# Altium project Mic_Amplifier.PrjPcb
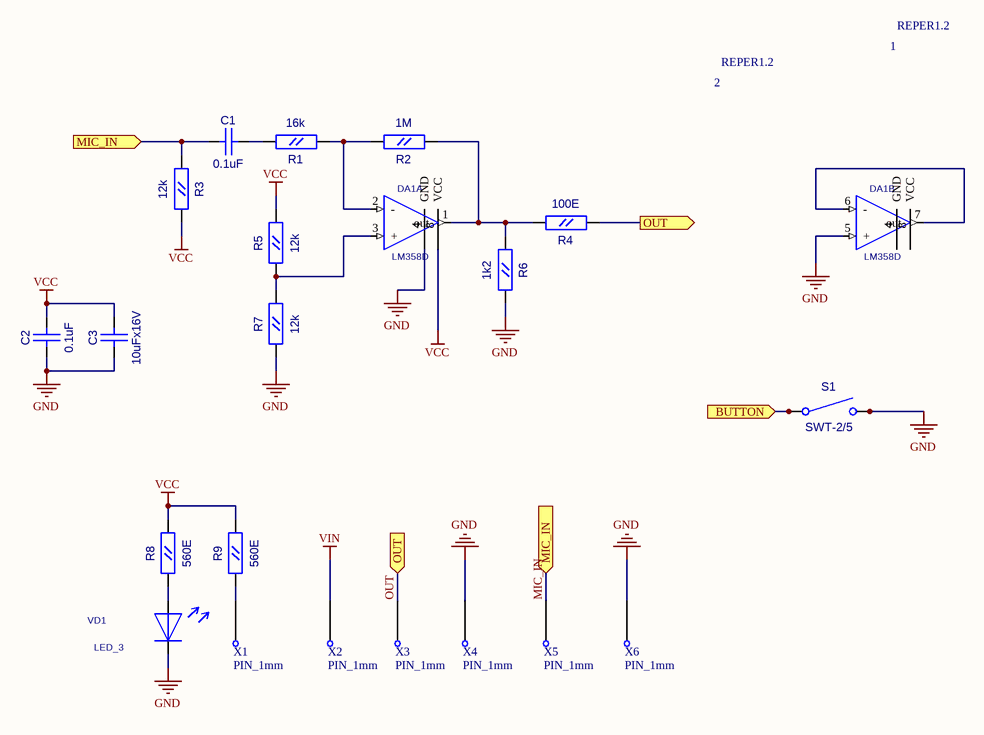
[diagram p0: Main.SchDoc]
2 sheets, 43 parts. Net scope: flat (ports and power ports of the same name join across sheets).
Board file: Mic_Amplifier.PcbDoc
Sheets:
  Main.SchDoc
  ON_OFF.SchDoc

## Sheet Main.SchDoc
size A4

### Parts
1  REPER1.2  [REPER1.2]
2  REPER1.2  [REPER1.2]
C1  0.1uF  [CC0805]
C2  0.1uF  [CC0805]
C3  10uFx16V  [CC0805]
DA1  LM358D  [SO-8]  (parts A,B of 2)
R1  16k  [RC0805]
R2  1M  [RC0805]
R3  12k  [RC0805]
R4  100E  [RC0805]
R5  12k  [RC0805]
R6  1k2  [RC0805]
R7  12k  [RC0805]
R8  560E  [RC0805]
R9  560E  [RC0805]
S1  SWT-2/5  [7906H-1]
VD1  LED_3  [LED3]
X1  PIN_1mm  [PIN_1mm]
X2  PIN_1mm  [PIN_1mm]
X3  PIN_1mm  [PIN_1mm]
X4  PIN_1mm  [PIN_1mm]
X5  PIN_1mm  [PIN_1mm]
X6  PIN_1mm  [PIN_1mm]

### Ports
BUTTON (in), MIC_IN (in), OUT (in), OUT (out)

### Nets
GND: C2.1(A) C3.1(A) DA1.4(GND) DA1.5(+) R6.2(B) R7.1(A) S1.3(C2) S1.4 VD1.1 X4.1 X6.1
VCC: C2.2(B) C3.2(B) DA1.8(VCC) R3.2(B) R5.2(B) R8.2(B) R9.2(B)
VIN: X2.1
MIC_IN: C1.1(A) R3.1(A) X5.1 ; port MIC_IN
OUT: R4.1(A) X3.1 ; port OUT
NetC1_2: C1.2(B) R1.2(B)
NetC4_2: S1.1(C1) S1.2 ; port BUTTON
NetDA1_1: DA1.1(out) R2.1(A) R4.2(B) R6.1(A)
NetDA1_2: DA1.2(-) R1.1(A) R2.2(B)
NetDA1_3: DA1.3(+) R5.1(A) R7.2(B)
NetDA1_6: DA1.6(-) DA1.7(out)
NetR8_1: R8.1(A) VD1.2
NetR9_1: R9.1(A) X1.1

Not connected (* = marked no-connect by the designer): 1 1; 2 1

### Library data of the parts
C1-C3 = CC0805
  C1 C2: Value: 0.1uF
  C3: Value: 10uFx16V
R1-R9 = RC0805
  R1: Value: 16k
  R2: Value: 1M
  R3 R5 R7: Value: 12k
  R4: Value: 100E
  R6: Value: 1k2
  R8 R9: Value: 560E
S1 = SWT-2/5: Switch, Single Pole, Single Throw, Normally Open; Value: SWT-2/5
1 2 = REPER1.2: Value: *
DA1 = LM358D: Value: *
VD1 = LED_3: Value: *

## Sheet ON_OFF.SchDoc
size A4
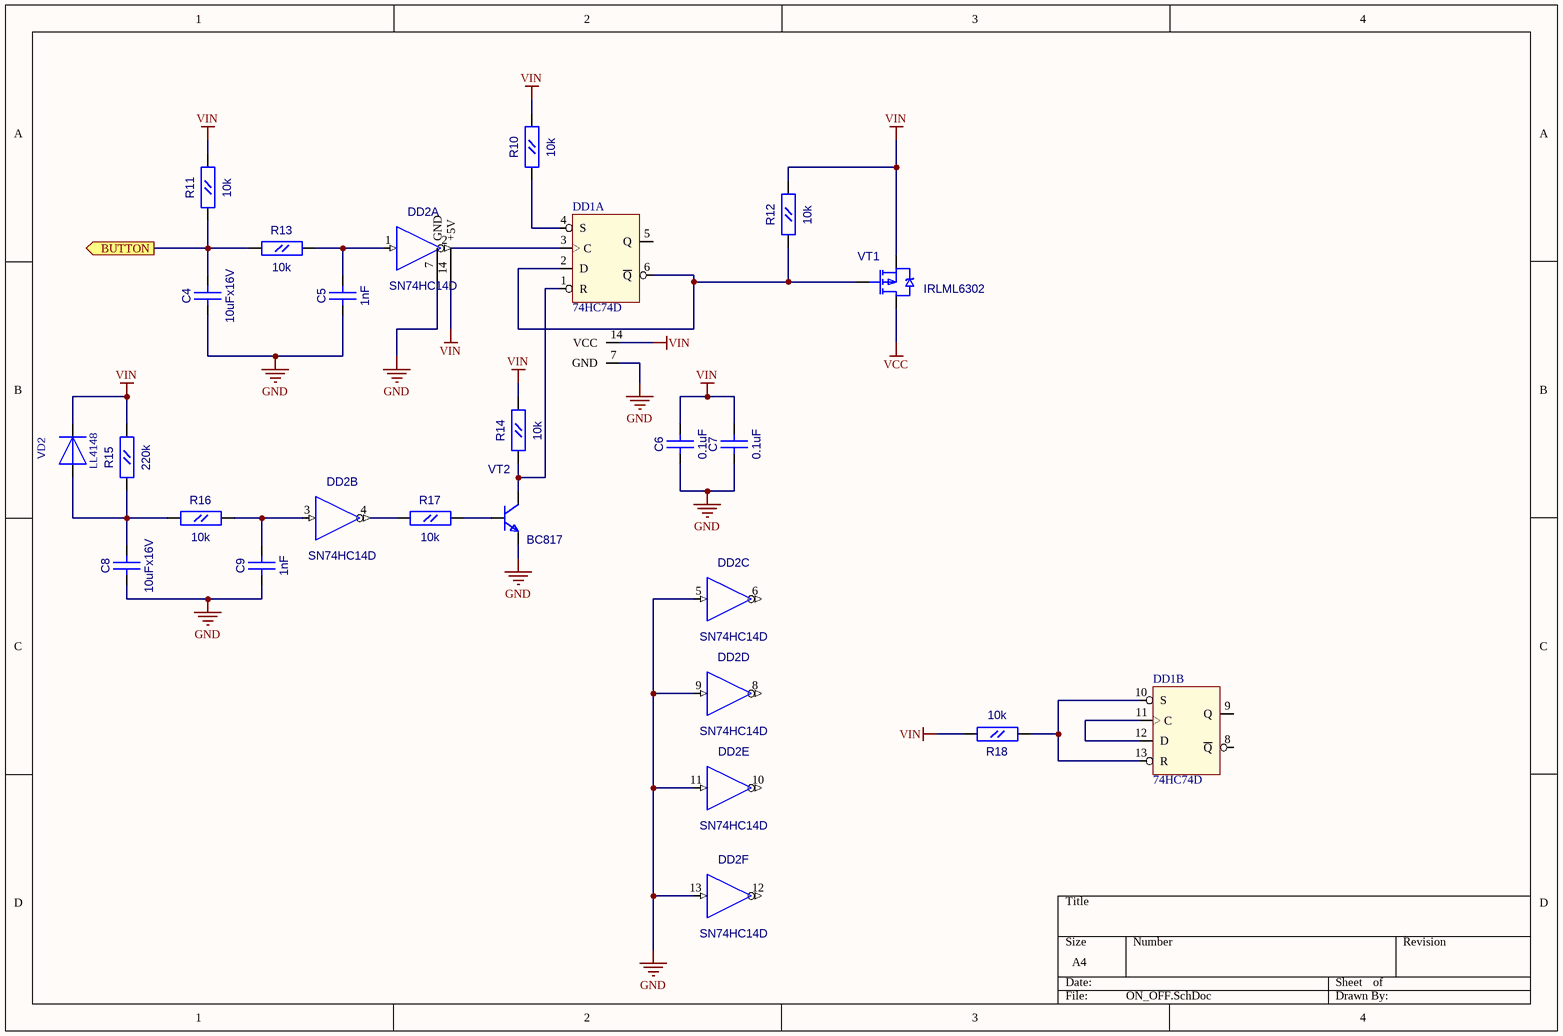
[diagram p1: ON_OFF.SchDoc]

### Parts
C4  10uFx16V  [CC0805]
C5  1nF  [CC0805]
C6  0.1uF  [CC0805]
C7  0.1uF  [CC0805]
C8  10uFx16V  [CC0805]
C9  1nF  [CC0805]
DD1  74HC74D  [SO14]  (parts A,B of 2)
DD2  SN74HC14D  [SO14]  (parts A,B,C,D,E,F of 6)
R10  10k  [RC0805]
R11  10k  [RC0805]
R12  10k  [RC0805]
R13  10k  [RC0805]
R14  10k  [RC0805]
R15  220k  [RC0805]
R16  10k  [RC0805]
R17  10k  [RC0805]
R18  10k  [RC0805]
VD2  LL4148  [SOD-80]
VT1  IRLML6302  [SOT-23(123)]
VT2  BC817  [SOT-23(123)]

### Ports
BUTTON (out)

### Nets
GND: C4.1(A) C5.1(A) C6.1(A) C7.1(A) C8.1(A) C9.1(A) DD1.7(GND) DD2.5(A) DD2.7(GND) DD2.9(A) DD2.11(A) DD2.13(A) VT2.2(E)
VCC: VT1.3(D)
VIN: C6.2(B) C7.2(B) DD1.14(VCC) DD2.14(+5V) R10.2(B) R11.2(B) R12.2(B) R14.2(B) R15.2(B) R18.2(B) VD2.2(+) VT1.2(S)
NetC4_2: C4.2(B) R11.1(A) R13.1(A) ; port BUTTON
NetC5_2: C5.2(B) DD2.1(A) R13.2(B)
NetC8_2: C8.2(B) R15.1(A) R16.1(A) VD2.1(-)
NetC9_2: C9.2(B) DD2.3(A) R16.2(B)
NetDD1_1: DD1.1(R) R14.1(A) VT2.3(C)
NetDD1_2: DD1.2(D) DD1.6(~{Q}) R12.1(A) VT1.1(G)
NetDD1_3: DD1.3(C) DD2.2(Y)
NetDD1_4: DD1.4(S) R10.1(A)
NetDD1_10: DD1.10(S) DD1.13(R) R18.1(A)
NetDD1_11: DD1.11(C) DD1.12(D)
NetDD2_4: DD2.4(Y) R17.1(A)
NetR17_2: R17.2(B) VT2.1(B)

Not connected (* = marked no-connect by the designer): DD1 5(Q) 8(~{Q}) 9(Q); DD2 6(Y) 8(Y) 10(Y) 12(Y)

### Library data of the parts
C4-C9 = CC0805
  C4 C8: Value: 10uFx16V
  C5 C9: Value: 1nF
  C6 C7: Value: 0.1uF
DD2 = SN74HC14D: Hex Schmitt-Trigger INVERTERS; Value: *
R10-R18 = RC0805
  R10-R14 R16-R18: Value: 10k
  R15: Value: 220k
VT1 = IRLML6402: HEXFET Power MOSFET; ComponentField7: Published 8-Jun-2000; OriginalName: IRLML6302; Value: IRLML6302
VT2 = BC846BLT1: ComponentField7: Published 29-Sep-2000; OriginalName: BC846BLT1; Value: BC817
VD2 = LL4148: Value: *

## Nets that join several sheets
GND: Main (11 pins), ON_OFF (13 pins)
VCC: Main (7 pins), ON_OFF (VT1.3)
VIN: Main (X2.1), ON_OFF (12 pins)
NetC4_2: Main (S1.1 S1.2), ON_OFF (C4.2 R11.1 R13.1)